# Altium schematic sheet MAIN.SchDoc
size 381 x 241 mm; SheetNumber: 1; SheetTotal: 7
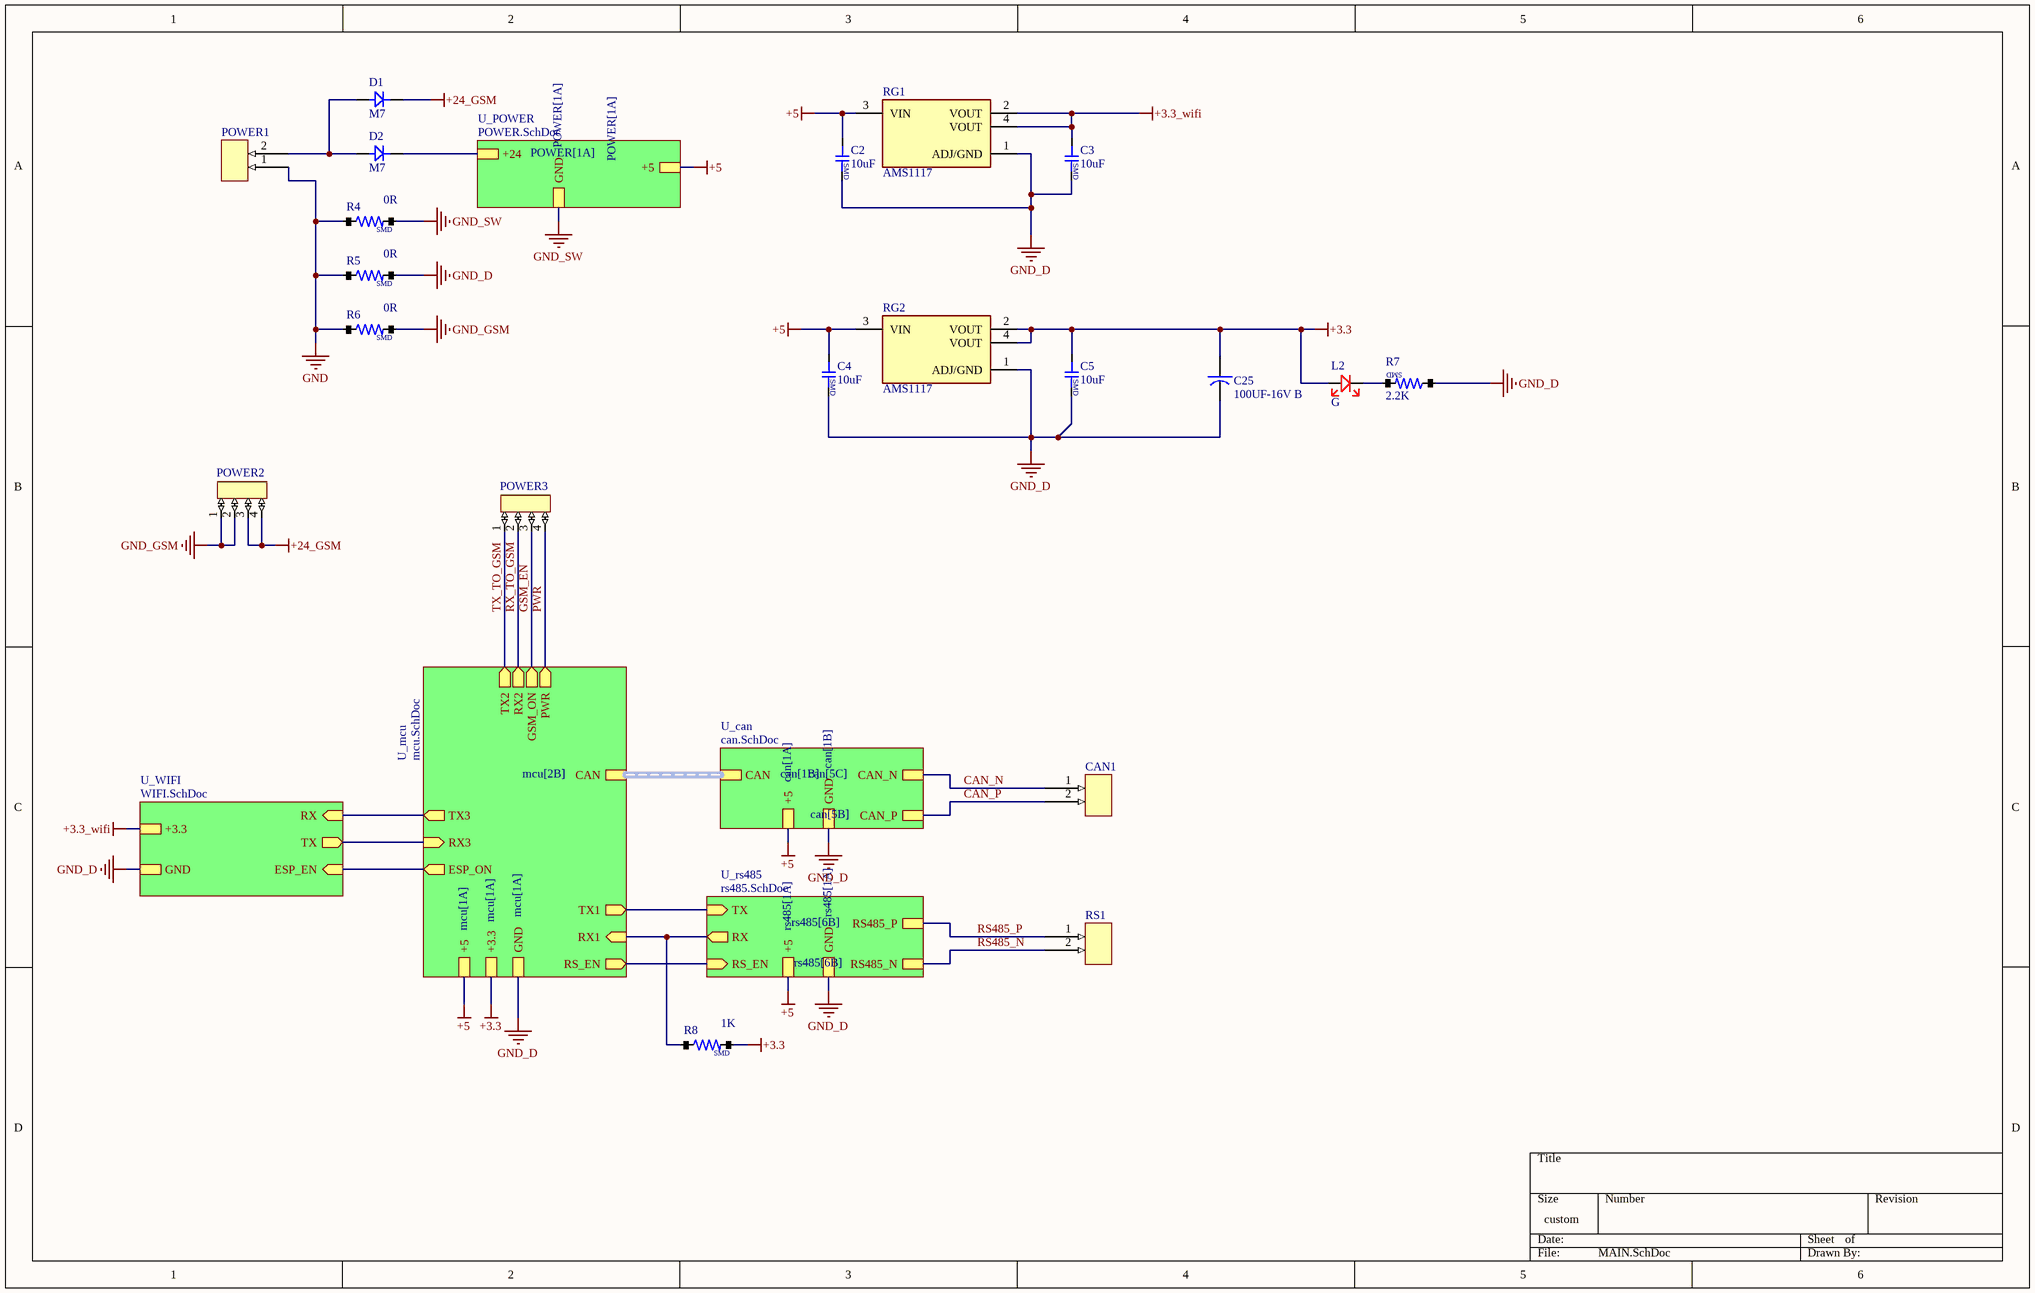
[diagram p0: MAIN.SchDoc]

## Parts
C2  10uF  [CAP-1206]
C3  10uF  [CAP-1206]
C4  10uF  [CAP-1206]
C5  10uF  [CAP-1206]
C25  100UF-16V B  [CAP_TANTAL_B]
CAN1  conector_2pin_power  [MSTBA 2,5]  (value not drawn)
D1  M7  [DIOD/1N4007/SMD]
D2  M7  [DIOD/1N4007/SMD]
L2  G  [LED/0805]
POWER1  (no value)  [CONECTOR/FONIX/2PIN]
POWER2  (no value)  [CONECTOR/XH/4PIN]
POWER3  (no value)  [CONECTOR/XH/4PIN]
R4  0R  [RES/0805]
R5  0R  [RES/0805]
R6  0R  [RES/0805]
R7  2.2K  [RES/0603]
R8  1K  [RES/0603]
RG1  AMS1117  [AMS1117]
RG2  AMS1117  [AMS1117]
RS1  conector_2pin_power  [MSTBA 2,5]  (value not drawn)

## Sub-sheets
U_can = can.SchDoc: GND, +5, CAN (harness CAN), CAN_P, CAN_N
U_mcu = mcu.SchDoc: GND, +5, +3.3, CAN (harness CAN), TX1 (out), RX1 (in), RS_EN (out), TX3 (out), RX3 (in), ESP_ON (out), TX2 (out), RX2 (out), PWR (out), GSM_ON (out)
U_POWER = POWER.SchDoc: GND, +24, +5
U_rs485 = rs485.SchDoc: GND, +5, RS485_N, RS485_P, TX (in), RS_EN (in), RX (out)
U_WIFI = WIFI.SchDoc: +3.3, GND, ESP_EN (in), RX (in), TX (out)

## Nets
+3.3: C5.1 C25.+ L2.A R8.2 RG2.2(VOUT) RG2.4(VOUT) ; sheet U_mcu/+3.3
+3.3_wifi: C3.1 RG1.2(VOUT) RG1.4(VOUT) ; sheet U_WIFI/+3.3
+5: C2.1 C4.1 RG1.3(VIN) RG2.3(VIN) ; sheet U_POWER/+5, sheet U_rs485/+5, sheet U_mcu/+5, sheet U_can/+5
+24_GSM: D1.K POWER2.3 POWER2.4
GND: POWER1.1 R4.1 R5.1 R6.1
GND_D: C2.2 C3.2 C4.2 C5.2 C25.- R5.2 R7.1 RG1.1(ADJ/GND) RG2.1(ADJ/GND) ; sheet U_rs485/GND, sheet U_mcu/GND, sheet U_can/GND, sheet U_WIFI/GND
GND_GSM: POWER2.1 POWER2.2 R6.2
GND_SW: R4.2 ; sheet U_POWER/GND
CAN_N: CAN1.1 ; sheet U_can/CAN_N
CAN_P: CAN1.2 ; sheet U_can/CAN_P
GSM_EN: POWER3.3 ; sheet U_mcu/GSM_ON
PWR: POWER3.4 ; sheet U_mcu/PWR
RS485_N: RS1.2 ; sheet U_rs485/RS485_N
RS485_P: RS1.1 ; sheet U_rs485/RS485_P
RX_TO_GSM: POWER3.2 ; sheet U_mcu/RX2
TX_TO_GSM: POWER3.1 ; sheet U_mcu/TX2
NetD1_A: D1.A D2.A POWER1.2
NetD2_K: D2.K ; sheet U_POWER/+24
NetL2_K: L2.K R7.2
NetR8_1: R8.1 ; sheet U_rs485/RX, sheet U_mcu/RX1
(unnamed): sheet U_rs485/TX, sheet U_mcu/TX1
(unnamed): sheet U_rs485/RS_EN, sheet U_mcu/RS_EN
(unnamed): sheet U_mcu/TX3, sheet U_WIFI/RX
(unnamed): sheet U_mcu/RX3, sheet U_WIFI/TX
(unnamed): sheet U_mcu/ESP_ON, sheet U_WIFI/ESP_EN

## Buses and harness runs
harness sheet U_can/CAN = sheet U_mcu/CAN

## Notes on the sheet
- (in symbol cap_smd) SMD
- (in symbol RES/SMD) SMD

## Library data of the parts
C2-C5 = cap_smd
C25 = cap-electrolit
D1 D2 = DIOD/RECTIFIERS
L2 = LED-1COLER
POWER1 = CONECTOR/FONIX/2PIN
POWER2 POWER3 = CONECTOR/XH/4PIN
R4-R8 = RES/SMD